# Altium project RC_Car_ATMEGA8.PrjPcb
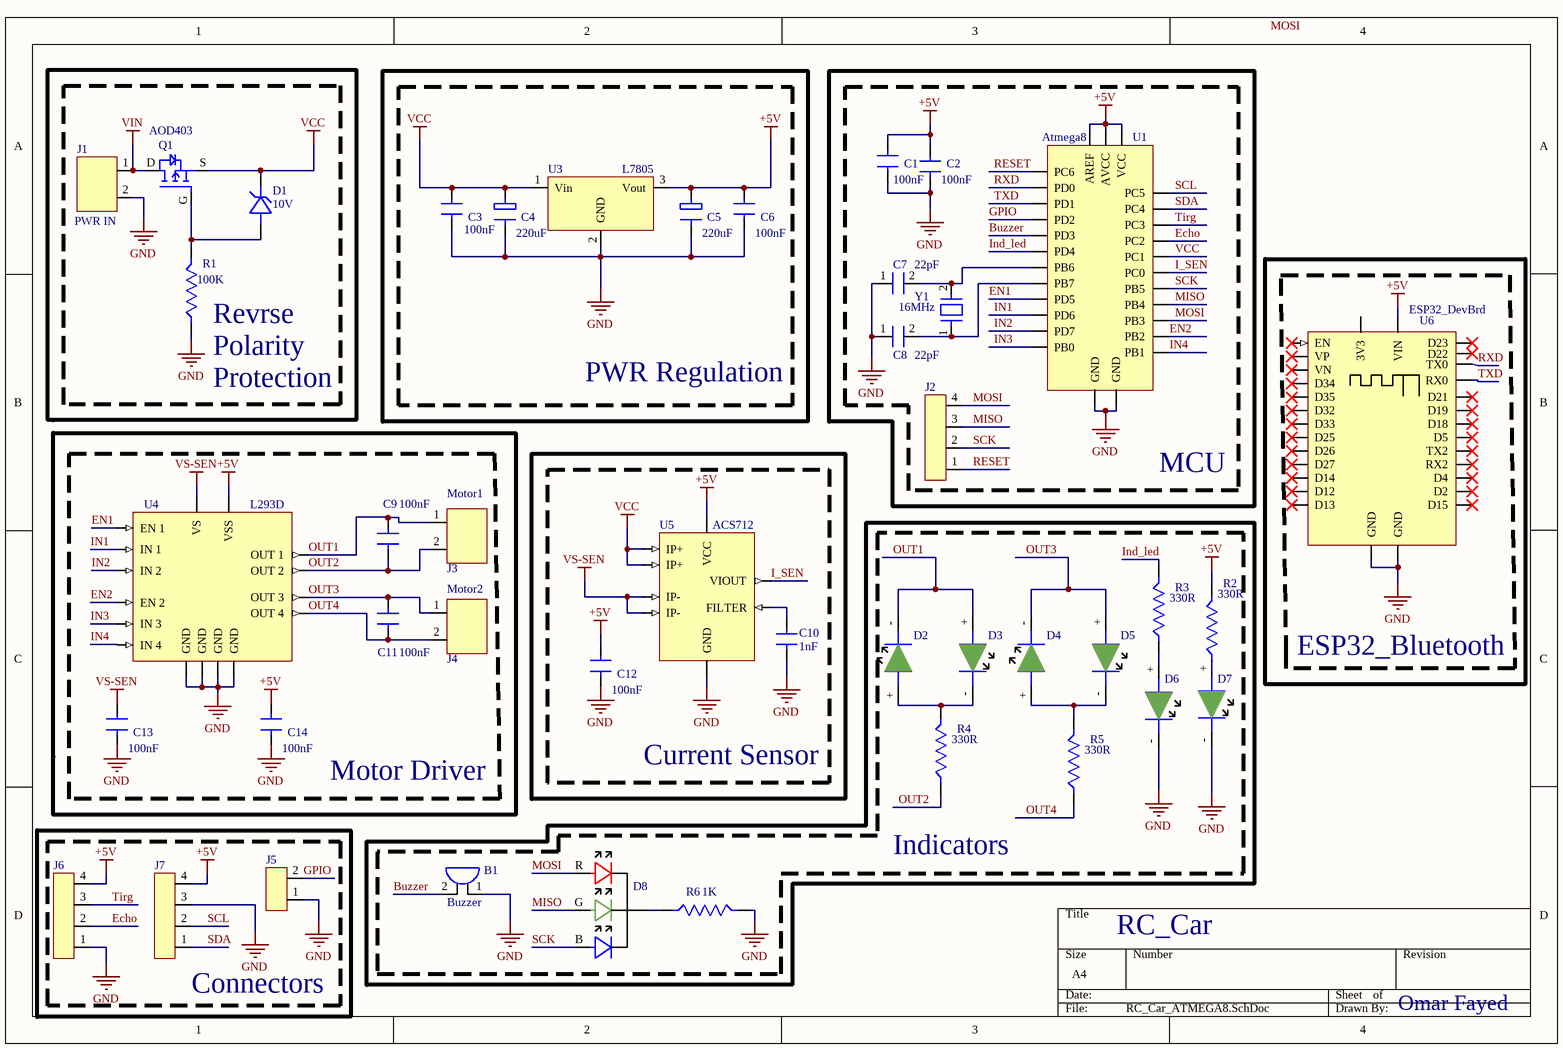
[diagram p0: RC_Car_ATMEGA8.SchDoc]
1 sheet, 43 parts. Net scope: global (net labels, ports and power ports of the same name join across sheets).
Board files: RC_Car_ATMEGA8.PcbDoc, Panel1.PcbDoc

## Sheet RC_Car_ATMEGA8.SchDoc: RC_Car
size A4; Date: 8/31/2023; Author: Omar Fayed; CompanyName: Aquaphotons; DrawnBy: Omar Fayed; SheetNumber: 1; SheetTotal: 1

### Parts
B1  Buzzer  [Buzzer 12mm]
C1  value 100nF  [MLCC_0603]  (hidden comment: MLCC_0603)
C2  value 100nF  [MLCC_0603]  (hidden comment: MLCC_0603)
C3  value 100nF  [MLCC_0603]  (hidden comment: MLCC_0603)
C4  value 220uF  [Cap_Pol_6*2.5]  (hidden comment: Cap_Pol_THT)
C5  value 220uF  [Cap_Pol_6*2.5]  (hidden comment: Cap_Pol_THT)
C6  value 100nF  [MLCC_0603]  (hidden comment: MLCC_0603)
C7  value 22pF  [Capacitor Ceramic]  (hidden comment: Capacitor Ceramic THT)
C8  Capacitor Ceramic THT  [Capacitor Ceramic]  (value not drawn)
C9  value 100nF  [MLCC_0603]  (hidden comment: MLCC_0603)
C10  value 1nF  [MLCC_0805]  (hidden comment: MLCC_0805)
C11  value 100nF  [MLCC_0603]  (hidden comment: MLCC_0603)
C12  value 100nF  [MLCC_0603]  (hidden comment: MLCC_0603)
C13  value 100nF  [MLCC_0603]  (hidden comment: MLCC_0603)
C14  value 100nF  [MLCC_0603]  (hidden comment: MLCC_0603)
D1  10V  [Zener_]
D2  LED THT  [LED THT 5mm]  (value not drawn)
D3  LED THT  [LED THT 5mm]  (value not drawn)
D4  LED THT  [LED THT 5mm]  (value not drawn)
D5  LED THT  [LED THT 5mm]  (value not drawn)
D6  LED THT  [LED THT 5mm]  (value not drawn)
D7  LED THT  [LED THT 5mm]  (value not drawn)
D8  RGB_LED_THT  [RGB LED THT]  (value not drawn)
J1  TerminalBlock_5mm  [TerminalBlock_5mm]  (value not drawn)
J2  PinSocket THT (1 * 4)  [PinSocket (1 * 4) 2.54]  (value not drawn)
J3  TerminalBlock_5mm  [TerminalBlock_5mm]  (value not drawn)
J4  TerminalBlock_5mm  [TerminalBlock_5mm]  (value not drawn)
J5  PinSocket 1 * 2  [PinSocket 1 * 2 2.54]  (value not drawn)
J6  PinSocket THT (1 * 4)  [PinSocket (1 * 4) 2.54]  (value not drawn)
J7  PinSocket THT (1 * 4)  [PinSocket (1 * 4) 2.54]  (value not drawn)
Q1  AOD403  [TO_252]
R1  value 100K  [Resistor_SMD_0603]  (hidden comment: Resistor_SMD_0603)
R2  value 330R  [Resistor THT]  (hidden comment: Resistor_THT)
R3  value 330R  [Resistor THT]  (hidden comment: Resistor_THT)
R4  value 330R  [Resistor THT]  (hidden comment: Resistor_THT)
R5  value 330R  [Resistor THT]  (hidden comment: Resistor_THT)
R6  value 1K  [Resistor THT]  (hidden comment: Resistor_THT)
U1  Atmega8  [Atmega8_DIP28]
U3  L7805  [L7805]
U4  L293D  [L293D_DIP16 - duplicate]
U5  ACS712  [ACS712_SOP8]
U6  ESP32_DevBrd  [ESP32_DevBrd_DIP30]
Y1  value 16MHz  [Crystal_THT]  (hidden comment: Crystal)

### Blocks framed on the sheet
PWR Regulation: C3-C6 U3
MCU: C1 C2 C7 C8 J2 U1 Y1
ESP32_Bluetooth: U6
Motor Driver: C9 C11 C13 C14 J3 J4 U4
Current Sensor: C10 C12 U5
Indicators: B1 D2-D8 R2-R6
Connectors: J5-J7

### Nets
+5V: C1.2 C2.2 C5.1(+) C6.2 C12.2 C14.2 J6.4 J7.4 R2.2 U1.7(VCC) U1.20(AVCC) U1.21(AREF) U3.3(Vout) U4.16(VSS) U5.8(VCC) U6.15(VIN)
GND: B1.1 C1.1 C2.1 C3.2 C4.2(-) C5.2(-) C6.1 C7.1 C8.1 C10.1 C12.1 C13.1 C14.1 D6.-(Cathode) D7.-(Cathode) J1.2 J5.1 J6.1 J7.3 R1.1 R6.2 U1.8(GND) U1.22(GND) U3.2(GND) U4.4(GND) U4.5(GND) U4.12(GND) U4.13(GND) U5.5(GND) U6.14(GND) U6.17(GND)
VCC: C3.1 C4.1(+) D1.-(Cathode) Q1.S U1.24(PC1) U3.1(Vin) U5.1(IP+) U5.2(IP+)
VIN: J1.1 Q1.D
VS-SEN: C13.2 U4.8(VS) U5.3(IP-) U5.4(IP-)
Buzzer: B1.2 U1.5(PD3)
Echo: J6.2 U1.25(PC2)
EN1: U1.11(PD5) U4.1(EN_1)
EN2: U1.16(PB2) U4.9(EN_2)
GPIO: J5.2 U1.4(PD2)
I_SEN: U1.23(PC0) U5.7(VIOUT)
IN1: U1.12(PD6) U4.2(IN_1)
IN2: U1.13(PD7) U4.7(IN_2)
IN3: U1.14(PB0) U4.10(IN_3)
IN4: U1.15(PB1) U4.15(IN_4)
Ind_led: R3.2 U1.6(PD4)
MISO: D8.G J2.3 U1.18(PB4)
MOSI: D8.R J2.4 U1.17(PB3)
OUT1: C9.2 D2.-(Cathode) D3.+(Anode) J3.1 U4.3(OUT_1)
OUT2: C9.1 J3.2 R4.1 U4.6(OUT_2)
OUT3: C11.2 D4.-(Cathode) D5.+(Anode) J4.1 U4.11(OUT_3)
OUT4: C11.1 J4.2 R5.1 U4.14(OUT_4)
RESET: J2.1 U1.1(PC6)
RXD: U1.2(PD0) U6.28(TX0)
SCK: D8.B J2.2 U1.19(PB5)
SCL: J7.2 U1.28(PC5)
SDA: J7.1 U1.27(PC4)
Tirg: J6.3 U1.26(PC3)
TXD: U1.3(PD1) U6.27(RX0)
NetC7_2: C7.2 U1.9(PB6) Y1.2
NetC8_2: C8.2 U1.10(PB7) Y1.1
NetC10_2: C10.2 U5.6(FILTER)
NetD1_+: D1.+(Anode) Q1.G R1.2
NetD2_+: D2.+(Anode) D3.-(Cathode) R4.2
NetD4_+: D4.+(Anode) D5.-(Cathode) R5.2
NetD6_+: D6.+(Anode) R3.1
NetD7_+: D7.+(Anode) R2.1
NetD8_-: D8.-(Cathode) R6.1

Not connected (* = marked no-connect by the designer): U6 1(EN)* 2(VP)* 3(VN)* 4(D34)* 5(D35)* 6(D32)* 7(D33)* 8(D25)* 9(D26)* 10(D27)* 11(D14)* 12(D12)* 13(D13)* 16(3V3) 18(D15)* 19(D2)* 20(D4)* 21(RX2)* 22(TX2)* 23(D5)* 24(D18)* 25(D19)* 26(D21)* 29(D22)* 30(D23)*

### Notes on the sheet
- (near J1) PWR IN
- (near R1) Revrse
- (near R1) Polarity
- (near R1) Protection
- (near J3) Motor1
- (near J4) Motor2
- Labels drawn without touching a wire or pin: MOSI
- (in symbol Capacitor Ceramic THT) 22pF

### Library data of the parts
D1 = Zener_SMD: Maniufacturer: *; Manufacturer Part#: *; Supplier: *; Supplier Part#: *
D2-D7 = LED THT: Through hole LED; Manufacturer: *; Manufacturer part NO.: *; Supplier: *; Supplier part No.: *
J1 J3 J4 = TerminalBlock_5mm: Screw terminal connector 2 * Pins; Manufacturer: *; Manufacturer Part No.: *; Supplier: *; Supplier part No.: *
Q1 = P-Mosfet_AOD403: AOD403 SMD MOSFET Transistor P-Channel 30V 15A 3.5V @ 250uA 6mΩ @ 20A,20V 2.5W TO-252-2(DPAK); Manufacturer: *; Manufacturer Part#: *; Supplier: *; Supplier Part#: *
U1 = Atemega8: MCU; Manufacturer: *; Manufacturer Part#: *; Supplier: *; Supplier Part#: *
U3 = L7805: 5V voltage regulator; Manufacturer: *; Manufacturer Part#: *; Supplier: *; Supplier Part#: *
U4 = L293D: Motor Driver; Manufacturer: *; Manufacturer Part#: *; Supplier: *; Supplier Part#: *
U5 = ACS712: Current sensor 5A; Manufacturer: *; Manufacturer Part#: *; Supllier: *; Supllier Part#: *
B1 = Buzzer: Manufacturer: *; Manufacturer Part#: *; Supplier: *; Supplier Part#: *
C1-C3 C6 C9 C11-C14 = MLCC_0603: Manufacturer: *; Manufacturer part #: *; Supplier: *; Supplier Part #: *
C4 C5 = Cap_Pol_THT: MAnufacturer: *; Manufacturer Part #: *; Supplier: *; Supplier Part #: *; Manufacturer: *; Manufacturer Part#: *; Supplier Part#: *
C10 = MLCC_0805: Manufacturer: *; Manufacturer Part #: *; Supplier: *; Supplier Part #: *
D8 = RGB_LED_THT: Manufacturer: *; Manufacturer Part#: *; Supplier: *; Supplier Part#: *
J2 J6 J7 = PinSocket THT (1 * 4): Manufacturer: *; Manufacturer Part#: *; Supplier: *; Supplier Part#: *
J5 = PinSocket 1 * 2: Manufacturer: *; Manufacturer Part #: *; Supplier: *; Supplier Part #: *; Parameter 1: *
R1 = Resistor_SMD_0603: Manufacturer: *; Manufacturer Part No.: *; Supplier: *; Supllier Part No.: *; Supplier part #: *; Manufacturerr: *; Manufacturer part #: *; Manufacturer Part#: *; Supplier Part#: *
R2-R6 = Resistor_THT: Manufacturer: *; Manufacturer Part No.: *; Supplier: *; Supllier Part No.: *; Supplier part #: *; Manufacturerr: *; Manufacturer part #: *; Manufacturer Part#: *; Supplier Part#: *
U6 = ESP32_DevBrd: Manufacturer: *; Manufacturer Part #: *; Supplier: *; Supplier Part #: *
Y1 = Crystal: Manufacturer: *; Manufacturer Part #: *; Supplier: *; Supplier Part #: *